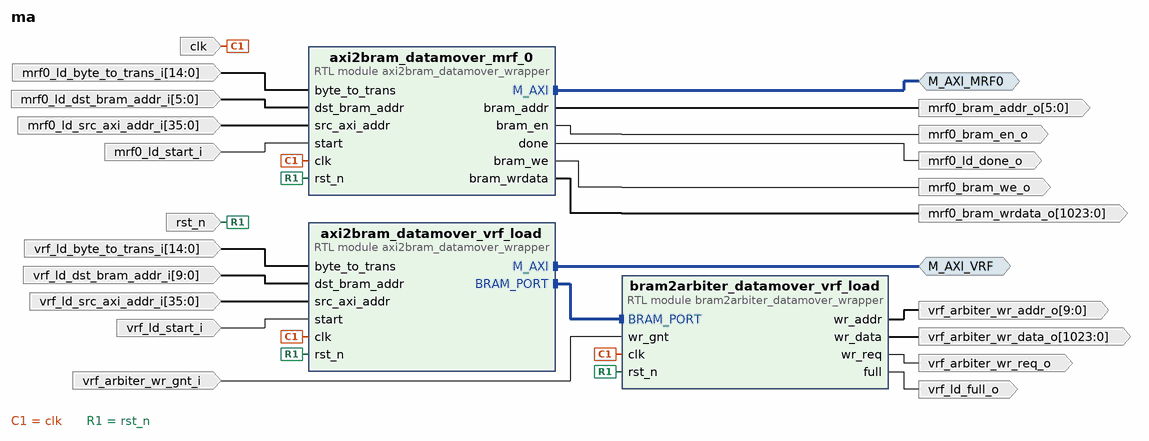
[diagram p0: block diagram of the top level]
# Vivado block design ma, xcu250-figd2104-2L-e, Vivado 2024.1
create_bd_design ma

create_bd_intf_port -mode Master -vlnv xilinx.com:interface:aximm_rtl:1.0 M_AXI_MRF0
set_property -dict [list \
  CONFIG.ADDR_WIDTH 36 \
  CONFIG.DATA_WIDTH 1024 \
  CONFIG.FREQ_HZ 200000000 \
  CONFIG.HAS_QOS 0 \
  CONFIG.HAS_REGION 0 \
  CONFIG.NUM_READ_OUTSTANDING 2 \
  CONFIG.NUM_WRITE_OUTSTANDING 2 \
  CONFIG.PROTOCOL AXI4 \
] [get_bd_intf_ports M_AXI_MRF0]
create_bd_intf_port -mode Master -vlnv xilinx.com:interface:aximm_rtl:1.0 M_AXI_VRF
set_property -dict [list \
  CONFIG.ADDR_WIDTH 36 \
  CONFIG.DATA_WIDTH 1024 \
  CONFIG.FREQ_HZ 200000000 \
  CONFIG.HAS_QOS 0 \
  CONFIG.HAS_REGION 0 \
  CONFIG.NUM_READ_OUTSTANDING 2 \
  CONFIG.NUM_WRITE_OUTSTANDING 2 \
  CONFIG.PROTOCOL AXI4 \
] [get_bd_intf_ports M_AXI_VRF]
create_bd_port -dir I -type clk clk
set_property -dict {CONFIG.ASSOCIATED_RESET rst_n CONFIG.FREQ_HZ 200000000} [get_bd_ports clk]
create_bd_port -dir I -type rst rst_n
create_bd_port -dir I -from 5 -to 0 mrf0_ld_dst_bram_addr_i
create_bd_port -dir I mrf0_ld_start_i
create_bd_port -dir I -from 35 -to 0 mrf0_ld_src_axi_addr_i
create_bd_port -dir I -from 14 -to 0 mrf0_ld_byte_to_trans_i
create_bd_port -dir O mrf0_ld_done_o
create_bd_port -dir I -from 14 -to 0 vrf_ld_byte_to_trans_i
create_bd_port -dir I -from 9 -to 0 vrf_ld_dst_bram_addr_i
create_bd_port -dir I -from 35 -to 0 vrf_ld_src_axi_addr_i
create_bd_port -dir I vrf_ld_start_i
create_bd_port -dir O vrf_ld_full_o
create_bd_port -dir O -from 1023 -to 0 vrf_arbiter_wr_data_o
create_bd_port -dir O -from 9 -to 0 vrf_arbiter_wr_addr_o
create_bd_port -dir I vrf_arbiter_wr_gnt_i
create_bd_port -dir O vrf_arbiter_wr_req_o
create_bd_port -dir O mrf0_bram_en_o
create_bd_port -dir O -from 1023 -to 0 mrf0_bram_wrdata_o
create_bd_port -dir O mrf0_bram_we_o
create_bd_port -dir O -from 5 -to 0 mrf0_bram_addr_o

create_bd_cell -type module -reference axi2bram_datamover_wrapper axi2bram_datamover_mrf_0
set_property -dict {CONFIG.BRAM_ADDRWIDTH 6 CONFIG.DATAWIDTH 1024} [get_bd_cells axi2bram_datamover_mrf_0]
create_bd_cell -type module -reference axi2bram_datamover_wrapper axi2bram_datamover_vrf_load
create_bd_cell -type module -reference bram2arbiter_datamover_wrapper bram2arbiter_datamover_vrf_load

# ---- connections ----

connect_bd_intf_net [get_bd_intf_ports M_AXI_MRF0] [get_bd_intf_pins axi2bram_datamover_mrf_0/M_AXI]
connect_bd_intf_net [get_bd_intf_pins bram2arbiter_datamover_vrf_load/BRAM_PORT] [get_bd_intf_pins axi2bram_datamover_vrf_load/BRAM_PORT]
connect_bd_intf_net [get_bd_intf_ports M_AXI_VRF] [get_bd_intf_pins axi2bram_datamover_vrf_load/M_AXI]
connect_bd_net -net axi2bram_datamover_done [get_bd_pins axi2bram_datamover_mrf_0/done] [get_bd_ports mrf0_ld_done_o]
connect_bd_net [get_bd_pins axi2bram_datamover_mrf_0/bram_addr] [get_bd_ports mrf0_bram_addr_o]
connect_bd_net [get_bd_pins axi2bram_datamover_mrf_0/bram_en] [get_bd_ports mrf0_bram_en_o]
connect_bd_net [get_bd_pins axi2bram_datamover_mrf_0/bram_we] [get_bd_ports mrf0_bram_we_o]
connect_bd_net [get_bd_pins axi2bram_datamover_mrf_0/bram_wrdata] [get_bd_ports mrf0_bram_wrdata_o]
connect_bd_net -net bram2arbiter_datamov_0_full [get_bd_pins bram2arbiter_datamover_vrf_load/full] [get_bd_ports vrf_ld_full_o]
connect_bd_net [get_bd_pins bram2arbiter_datamover_vrf_load/wr_addr] [get_bd_ports vrf_arbiter_wr_addr_o]
connect_bd_net [get_bd_pins bram2arbiter_datamover_vrf_load/wr_data] [get_bd_ports vrf_arbiter_wr_data_o]
connect_bd_net [get_bd_pins bram2arbiter_datamover_vrf_load/wr_req] [get_bd_ports vrf_arbiter_wr_req_o]
connect_bd_net -net byte_to_trans_0_1 [get_bd_ports mrf0_ld_byte_to_trans_i] [get_bd_pins axi2bram_datamover_mrf_0/byte_to_trans]
connect_bd_net -net byte_to_trans_0_2 [get_bd_ports vrf_ld_byte_to_trans_i] [get_bd_pins axi2bram_datamover_vrf_load/byte_to_trans]
connect_bd_net -net clk_0_1 [get_bd_ports clk] \
  [get_bd_pins bram2arbiter_datamover_vrf_load/clk] [get_bd_pins axi2bram_datamover_mrf_0/clk] \
  [get_bd_pins axi2bram_datamover_vrf_load/clk]
connect_bd_net -net dst_bram_addr_0_1 [get_bd_ports mrf0_ld_dst_bram_addr_i] [get_bd_pins axi2bram_datamover_mrf_0/dst_bram_addr]
connect_bd_net -net dst_bram_addr_0_2 [get_bd_ports vrf_ld_dst_bram_addr_i] [get_bd_pins axi2bram_datamover_vrf_load/dst_bram_addr]
connect_bd_net -net rst_n_0_1 [get_bd_ports rst_n] \
  [get_bd_pins bram2arbiter_datamover_vrf_load/rst_n] [get_bd_pins axi2bram_datamover_mrf_0/rst_n] \
  [get_bd_pins axi2bram_datamover_vrf_load/rst_n]
connect_bd_net -net src_axi_addr_0_1 [get_bd_ports mrf0_ld_src_axi_addr_i] [get_bd_pins axi2bram_datamover_mrf_0/src_axi_addr]
connect_bd_net -net src_axi_addr_0_2 [get_bd_ports vrf_ld_src_axi_addr_i] [get_bd_pins axi2bram_datamover_vrf_load/src_axi_addr]
connect_bd_net -net start_0_1 [get_bd_ports mrf0_ld_start_i] [get_bd_pins axi2bram_datamover_mrf_0/start]
connect_bd_net -net start_0_2 [get_bd_ports vrf_ld_start_i] [get_bd_pins axi2bram_datamover_vrf_load/start]
connect_bd_net -net wr_gnt_0_1 [get_bd_ports vrf_arbiter_wr_gnt_i] [get_bd_pins bram2arbiter_datamover_vrf_load/wr_gnt]

# ---- address map ----
assign_bd_address -offset 0x000000000 -range 16G -target_address_space [get_bd_addr_spaces axi2bram_datamover_mrf_0/M_AXI] [get_bd_addr_segs M_AXI_MRF0/Reg]
assign_bd_address -offset 0x000000000 -range 16G -target_address_space [get_bd_addr_spaces axi2bram_datamover_vrf_load/M_AXI] [get_bd_addr_segs M_AXI_VRF/Reg]

validate_bd_design
save_bd_design
